# Altium schematic sheet ES108FC1转接.SchDoc
size A4; SheetNumber: 1; SheetTotal: 1
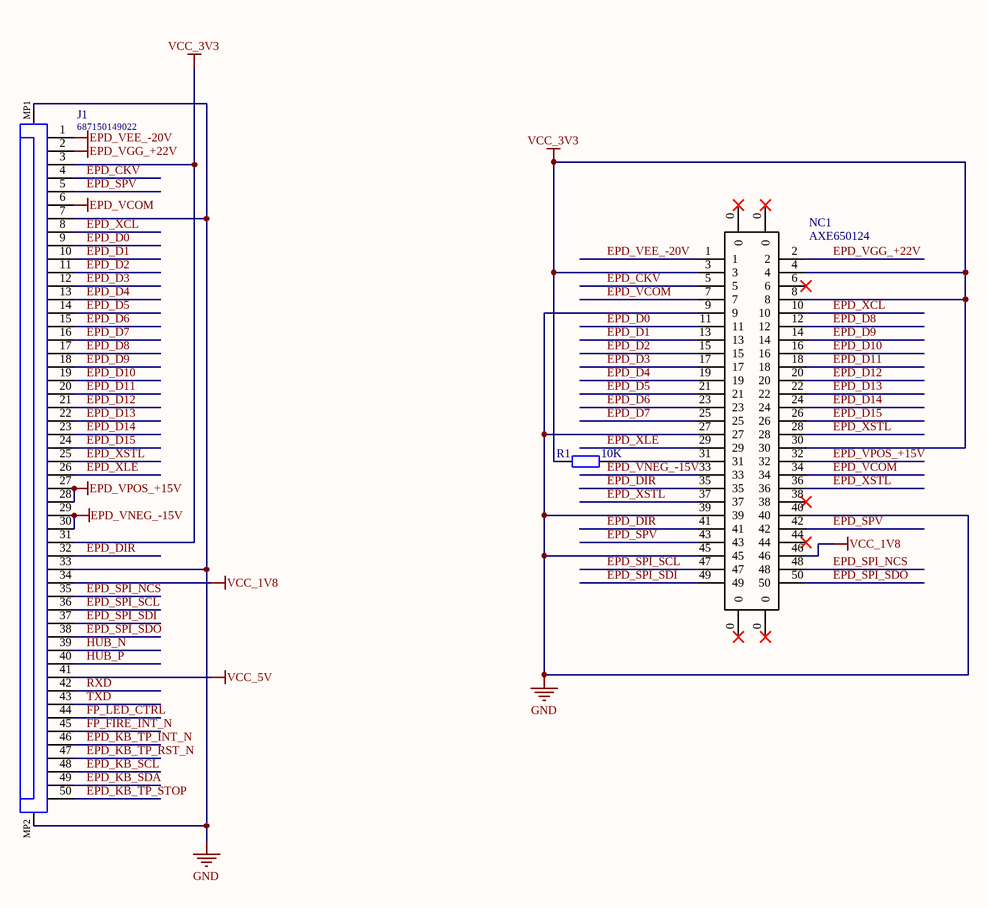
[diagram p0: ES108FC1转接.SchDoc]

## Parts
J1  687150149022  [687150149022]
NC1  AXE650124  [AXE650124]
R1  10K  [R0402_L]

## Nets
EPD_VCOM: J1.6 NC1.7 NC1.34
EPD_VEE_-20V: J1.1 NC1.1
EPD_VGG_+22V: J1.2 NC1.2
EPD_VNEG_-15V: J1.29 J1.30 NC1.33
EPD_VPOS_+15V: J1.27 J1.28 NC1.32
GND: J1.7 J1.33 J1.MP1 J1.MP2 NC1.9 NC1.27 NC1.39 NC1.40 NC1.45
VCC_1V8: J1.34 NC1.46
VCC_3V3: J1.3 J1.31 NC1.3 NC1.4 NC1.8 NC1.30 R1.1
VCC_5V: J1.41
EPD_CKV: J1.4 NC1.5
EPD_D0: J1.9 NC1.11
EPD_D1: J1.10 NC1.13
EPD_D2: J1.11 NC1.15
EPD_D3: J1.12 NC1.17
EPD_D4: J1.13 NC1.19
EPD_D5: J1.14 NC1.21
EPD_D6: J1.15 NC1.23
EPD_D7: J1.16 NC1.25
EPD_D8: J1.17 NC1.12
EPD_D9: J1.18 NC1.14
EPD_D10: J1.19 NC1.16
EPD_D11: J1.20 NC1.18
EPD_D12: J1.21 NC1.20
EPD_D13: J1.22 NC1.22
EPD_D14: J1.23 NC1.24
EPD_D15: J1.24 NC1.26
EPD_DIR: J1.32 NC1.35 NC1.41
EPD_KB_SCL: J1.48
EPD_KB_SDA: J1.49
EPD_KB_TP_INT_N: J1.46
EPD_KB_TP_RST_N: J1.47
EPD_KB_TP_STOP: J1.50
EPD_SPI_NCS: J1.35 NC1.48
EPD_SPI_SCL: J1.36 NC1.47
EPD_SPI_SDI: J1.37 NC1.49
EPD_SPI_SDO: J1.38 NC1.50
EPD_SPV: J1.5 NC1.42 NC1.43
EPD_XCL: J1.8 NC1.10
EPD_XLE: J1.26 NC1.29
EPD_XSTL: J1.25 NC1.28 NC1.36 NC1.37
FP_FIRE_INT_N: J1.45
FP_LED_CTRL: J1.44
HUB_N: J1.39
HUB_P: J1.40
RXD: J1.42
TXD: J1.43
NetNC1_31: NC1.31 R1.2

Not connected (* = marked no-connect by the designer): NC1 0* 6* 38* 44*

## Library data of the parts
J1 = CMP-1502-01644-1: SMT ZIF Connectors Hinge Type WR-FPC, Horizontal, Bottom Contact, pitch 0.5 mm, 50 pins; Manufacturer: Wurth Elektronik; Pin Number: 50; Contact Resistance: 50mOhm; Working Voltage: 50VAC; Withstanding Voltage: 150VAC; Rated Current: 0.5A; Pitch: 0.5mm; Contact Design: BottomContact; Datasheet URL: https://katalog.we-online.de/em/datasheet/687150149022.pdf; Part Number: 687150149022; Packaging: TapeandReel; Mounting Technology: SMT; Operating Temperature: -40to105degC; Orientation: Horizontal; Publisher: WurthElektronik; Manufacturer URL: http://www.we-online.de; Package Reference: 687150149022
R1 = R: 贴片电阻; 联系卖家，免费查找封装: 唯一出售店铺网址https://shop463601444.taobao.com; 封装库来自淘宝卖家ID：黄晶宝石: 其他店铺购入均为盗版假冒封装库，请立即申请退款; BOM名称: 贴片电阻